# EAGLE design MOSFET power board (EAGLE 9.6.0)
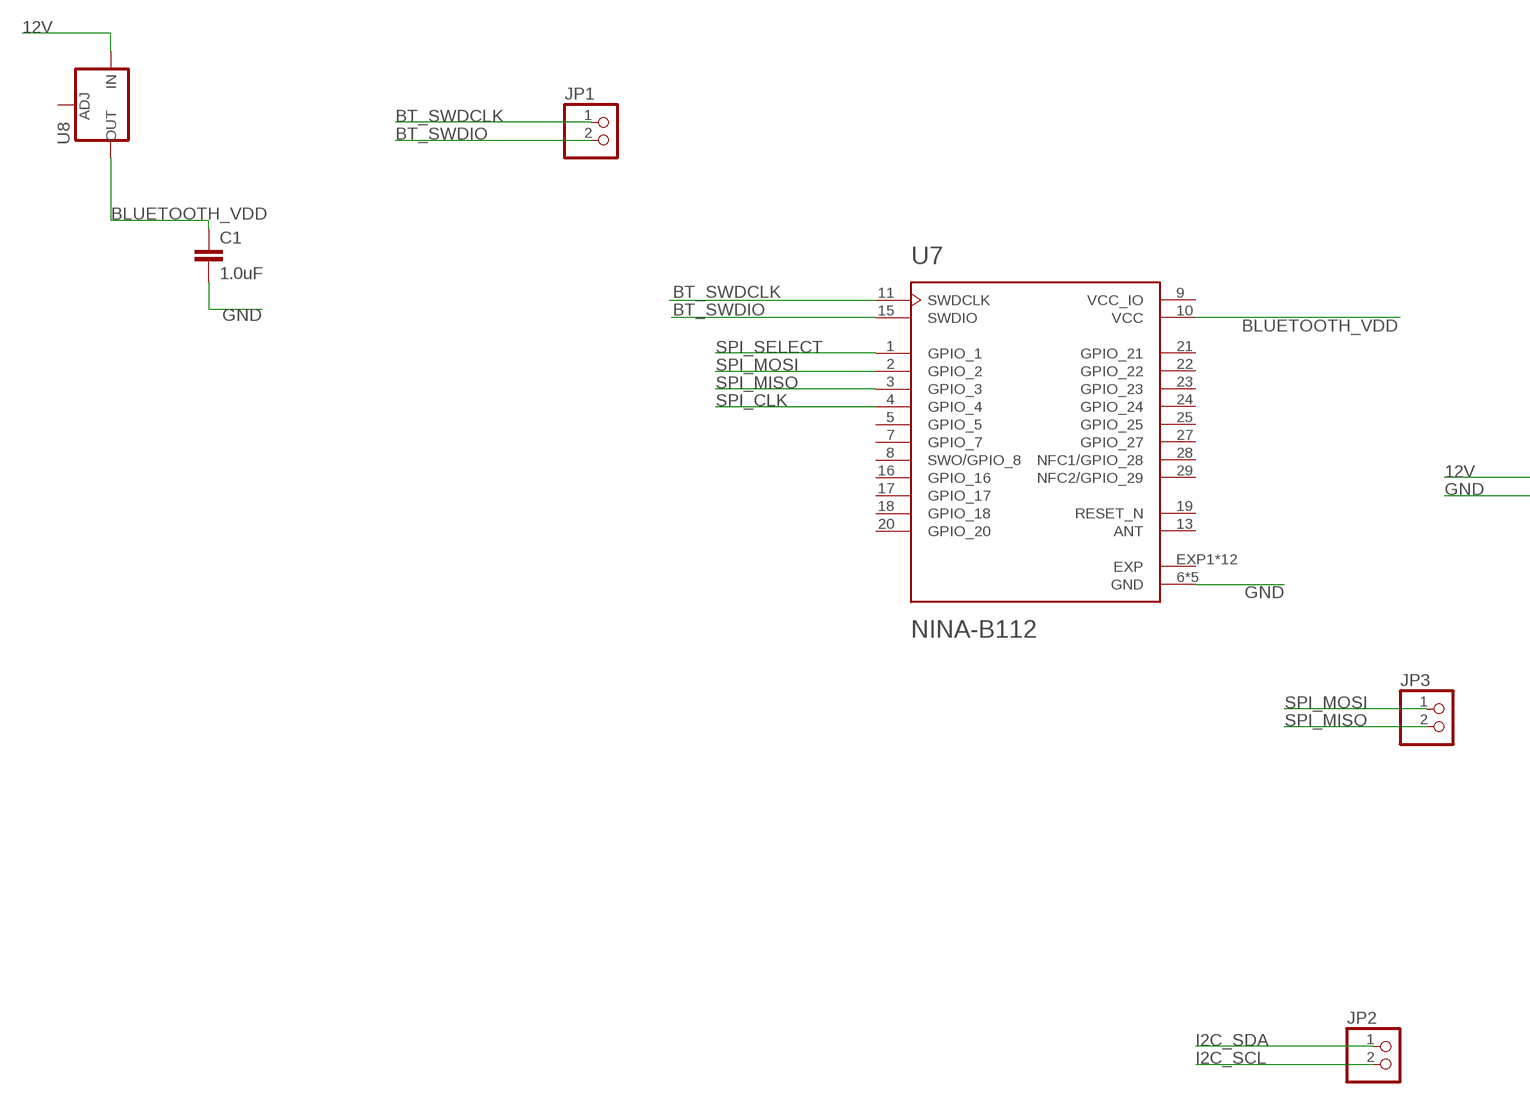
[diagram p0: schematic, sheet 1, part 1 of 2]
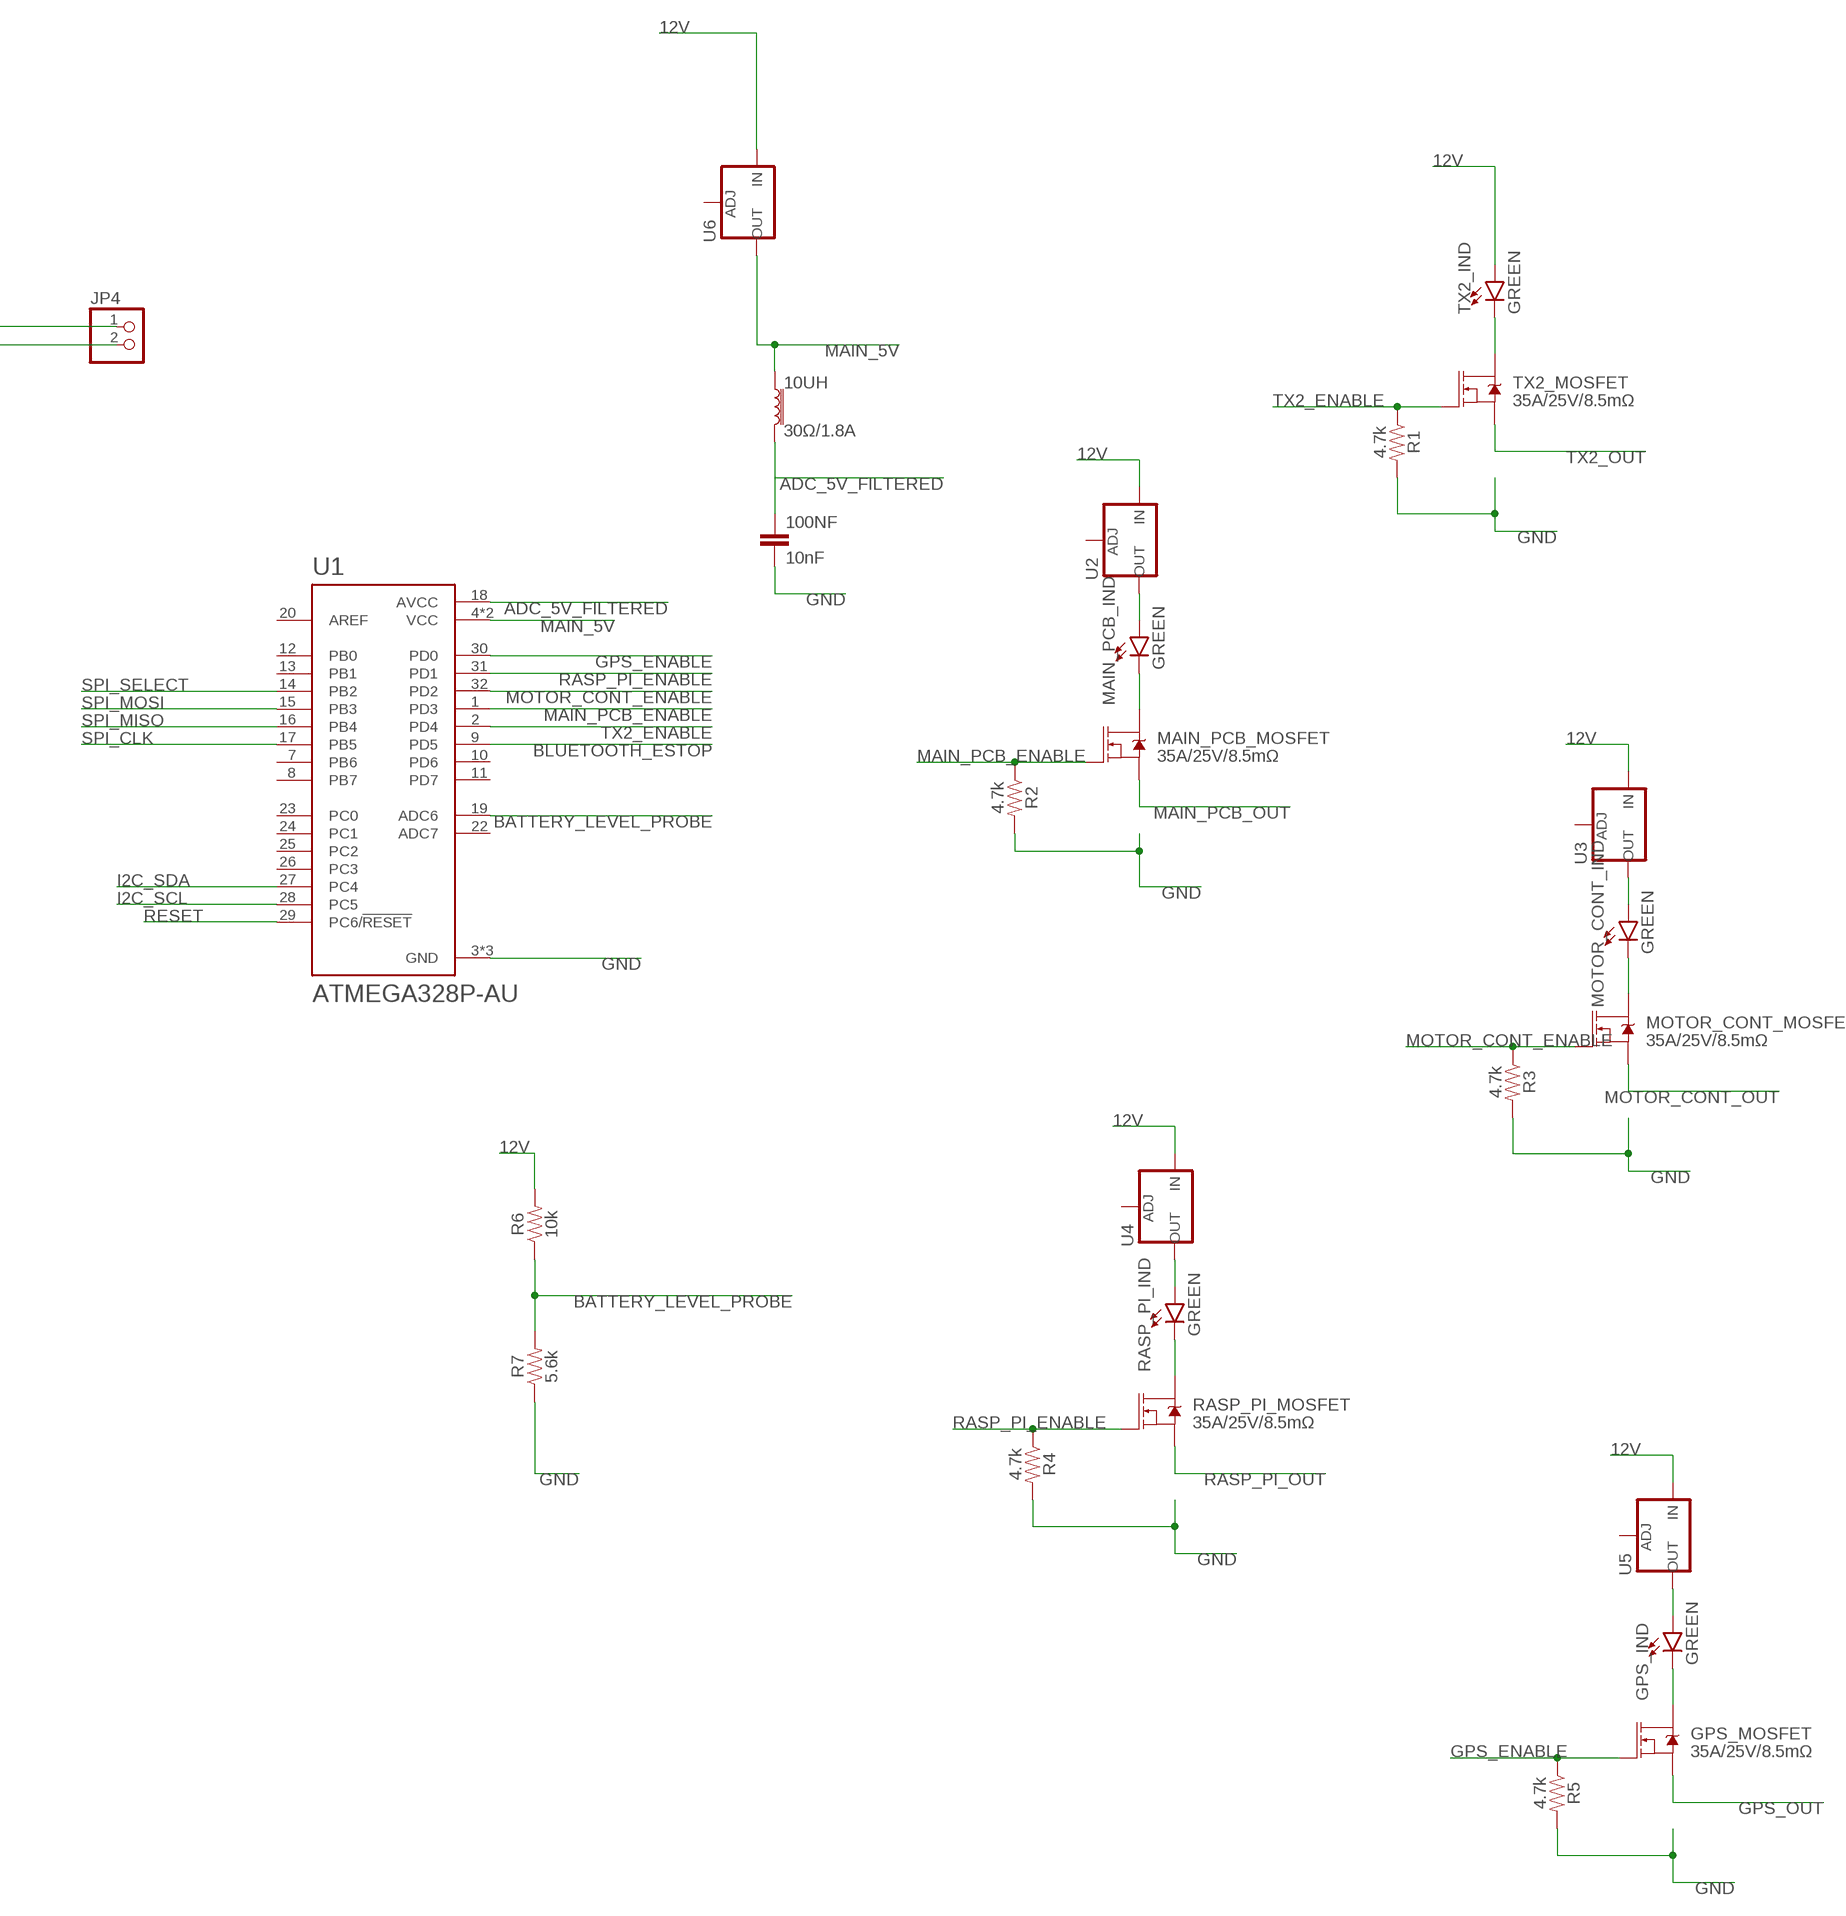
[diagram p1: schematic, sheet 1, part 2 of 2]

## Parts
10UH  30Ω/1.8A  FERRITE_BEAD-0603  [0603]
100NF  10nF  10NF-0603-50V-10%  [0603]
C1  1.0uF  1.0UF-0603-16V-10%  [0603]
GPS_IND  GREEN  LED-GREEN0603  [LED-0603]
GPS_MOSFET  35A/25V/8.5mΩ  MOSFET-NCH-FDD8780  [DPAK]
JP1  PINHD-1X2  [1X02]
JP2  PINHD-1X2  [1X02]
JP3  PINHD-1X2  [1X02]
JP4  PINHD-1X2  [1X02]
MAIN_PCB_IND  GREEN  LED-GREEN0603  [LED-0603]
MAIN_PCB_MOSFET  35A/25V/8.5mΩ  MOSFET-NCH-FDD8780  [DPAK]
MOTOR_CONT_IND  GREEN  LED-GREEN0603  [LED-0603]
MOTOR_CONT_MOSFET  35A/25V/8.5mΩ  MOSFET-NCH-FDD8780  [DPAK]
R1  4.7k  4.7KOHM-0603-1/10W-1%  [0603]
R2  4.7k  4.7KOHM-0603-1/10W-1%  [0603]
R3  4.7k  4.7KOHM-0603-1/10W-1%  [0603]
R4  4.7k  4.7KOHM-0603-1/10W-1%  [0603]
R5  4.7k  4.7KOHM-0603-1/10W-1%  [0603]
R6  10k  10KOHM-0603-1/10W-1%  [0603]
R7  5.6k  5.6KOHM-0603-1/10W-1%  [0603]
RASP_PI_IND  GREEN  LED-GREEN0603  [LED-0603]
RASP_PI_MOSFET  35A/25V/8.5mΩ  MOSFET-NCH-FDD8780  [DPAK]
TX2_IND  GREEN  LED-GREEN0603  [LED-0603]
TX2_MOSFET  35A/25V/8.5mΩ  MOSFET-NCH-FDD8780  [DPAK]
U1  ATMEGA328P-AU  [QFP80P900X900X120-32N]
U2  V_REG_LM1117SOT223  [SOT223]
U3  V_REG_LM1117SOT223  [SOT223]
U4  V_REG_LM1117SOT223  [SOT223]
U5  V_REG_LM1117SOT223  [SOT223]
U6  V_REG_LM1117SOT223  [SOT223]
U7  NINA-B112  [UBLOX_NINA-B112]
U8  V_REG_LM1117SOT223  [SOT223]

## Nets
12V: JP4.1 R6.2 TX2_IND.A U2.3(IN) U3.3(IN) U4.3(IN) U5.3(IN) U6.3(IN) U8.3(IN)
ADC_5V_FILTERED: 10UH.2 100NF.1 U1.18(AVCC)
BATTERY_LEVEL_PROBE: R6.1 R7.2 U1.19(ADC6)
BLUETOOTH_ESTOP: U1.9(PD5)
BLUETOOTH_VDD: C1.1 U7.10(VCC) U8.2(OUT) U8.4(OUT)
BT_SWDCLK: JP1.1 U7.11(SWDCLK)
BT_SWDIO: JP1.2 U7.15(SWDIO)
GND: 100NF.2 C1.2 JP4.2 R1.2 R2.2 R3.2 R4.2 R5.2 R7.1 U1.3(GND) U1.5(GND) U1.21(GND) U7.6(GND) U7.12(GND) U7.14(GND) U7.26(GND) U7.30(GND)
GPS_ENABLE: GPS_MOSFET.1(G) R5.1 U1.30(PD0)
GPS_OUT: GPS_MOSFET.3(S)
I2C_SCL: JP2.2 U1.28(PC5)
I2C_SDA: JP2.1 U1.27(PC4)
MAIN_5V: 10UH.1 U1.4(VCC) U1.6(VCC) U6.2(OUT) U6.4(OUT)
MAIN_PCB_ENABLE: MAIN_PCB_MOSFET.1(G) R2.1 U1.1(PD3)
MAIN_PCB_OUT: MAIN_PCB_MOSFET.3(S)
MOTOR_CONT_ENABLE: MOTOR_CONT_MOSFET.1(G) R3.1 U1.32(PD2)
MOTOR_CONT_OUT: MOTOR_CONT_MOSFET.3(S)
N$1: MAIN_PCB_IND.C MAIN_PCB_MOSFET.4(D)
N$2: MAIN_PCB_IND.A U2.2(OUT) U2.4(OUT)
N$3: MOTOR_CONT_IND.C MOTOR_CONT_MOSFET.4(D)
N$4: MOTOR_CONT_IND.A U3.2(OUT) U3.4(OUT)
N$5: RASP_PI_IND.C RASP_PI_MOSFET.4(D)
N$6: RASP_PI_IND.A U4.2(OUT) U4.4(OUT)
N$7: GPS_IND.C GPS_MOSFET.4(D)
N$8: GPS_IND.A U5.2(OUT) U5.4(OUT)
N$9: TX2_IND.C TX2_MOSFET.4(D)
RASP_PI_ENABLE: R4.1 RASP_PI_MOSFET.1(G) U1.31(PD1)
RASP_PI_OUT: RASP_PI_MOSFET.3(S)
RESET: U1.29(PC6/!RESET)
SPI_CLK: U1.17(PB5) U7.4(GPIO_4)
SPI_MISO: JP3.2 U1.16(PB4) U7.3(GPIO_3)
SPI_MOSI: JP3.1 U1.15(PB3) U7.2(GPIO_2)
SPI_SELECT: U1.14(PB2) U7.1(GPIO_1)
TX2_ENABLE: R1.1 TX2_MOSFET.1(G) U1.2(PD4)
TX2_OUT: TX2_MOSFET.3(S)
Unconnected: U1.7(PB6) U1.8(PB7) U1.10(PD6) U1.11(PD7) U1.12(PB0) U1.13(PB1) U1.20(AREF) U1.22(ADC7) U1.23(PC0) U1.24(PC1) U1.25(PC2) U1.26(PC3) U2.1(ADJ) U3.1(ADJ) U4.1(ADJ) U5.1(ADJ) U6.1(ADJ) U7.5(GPIO_5) U7.7(GPIO_7) U7.8(SWO/GPIO_8) U7.13(ANT) U7.16(GPIO_16) U7.17(GPIO_17) U7.18(GPIO_18) U7.19(RESET_N) U7.20(GPIO_20) U7.21(GPIO_21) U7.22(GPIO_22) U7.23(GPIO_23) U7.24(GPIO_24) U7.25(GPIO_25) U7.27(GPIO_27) U7.28(NFC1/GPIO_28) U7.29(NFC2/GPIO_29) U8.1(ADJ)

## Power pins joined to a net without a drawn wire
EXP: U7.EXP1(EXP) U7.EXP2(EXP) U7.EXP3(EXP) U7.EXP4(EXP) U7.EXP5(EXP) U7.EXP6(EXP) U7.EXP7(EXP) U7.EXP8(EXP) U7.EXP9(EXP) U7.EXP10(EXP) U7.EXP11(EXP) U7.EXP12(EXP)
VCC_IO: U7.9(VCC_IO)

## Library data of the parts
10UH = SparkFun-Coils:FERRITE_BEAD: Ferrite Bead (blocks, cores, rings, chokes, etc.) Inductor with layers of ferrite used to suppress high frequencies. Often used to isolate high frequency noise. SparkFun Products: IOIO-OTG - V2.2 <https://www.sparkfun.com/products/13613> SparkFun SAMD21 Mini Breakout <https://www.sparkfun.com/products/13664> SparkFun 6 Degrees of Freedom Breakout - LSM6DS3 <https://www.sparkfun.com/products/13339> SparkFun SAMD21 Dev Breakout <https://www.sparkfun.com/products/13672>; PROD_ID: NDUC-13805
100NF = SparkFun-Capacitors:10NF: 0.01uF/10nF/10,000pF ceramic capacitors A capacitor is a passive two-terminal electrical component used to store electrical energy temporarily in an electric field. CAP-09321; PROD_ID: CAP-00867
C1 = SparkFun-Capacitors:1.0UF: 1µF ceramic capacitors A capacitor is a passive two-terminal electrical component used to store electrical energy temporarily in an electric field.; PROD_ID: CAP-00868
GPS_IND MAIN_PCB_IND MOTOR_CONT_IND RASP_PI_IND TX2_IND = SparkFun-LED:LED-GREEN: Green SMD LED Used in manufacturing of various products at SparkFun Packages: 0603 - SMD 0603 package [Product Link] <http://www.futureelectronics.com/en/technologies/semiconductors/optoelectronics/leds/Pages/9894312-LTST-C190GKT.aspx?CrossPart=HSMG-C190&IM=0> LilyPad 1206 - SMD1206 LilyPad package [Product Link] <http://www.futureelectronics.com/en/Technologies/Product.aspx?ProductID=IN150NGHARVATEKCORPORATION2049943&IM=0> 1206 - SMD1206 package [Product Link] <http://www.futureelectronics.com/en/technologies/semiconductors/optoelectronics/leds/Pages/8315665-LTST-C150KGKT.aspx?IM=0> 1206 Bottom Mount -SMD 1206 Bottom Mount [Product Link] <http://www.digikey.com/product-detail/en/lite-on-inc/LTST-C230KGKT/160-1456-1-ND/386854> SparkFun Products: Pro Mini 328 -5V <https://www.sparkfun.com/products/821> RedBoard <https://www.sparkfun.com/products/12757> MP3 Trigger <https://www.sparkfun.com/products/13720> Makey Makey <https://www.sparkfun.com/products/11076>; PROD_ID: DIO-00821
GPS_MOSFET MAIN_PCB_MOSFET MOTOR_CONT_MOSFET RASP_PI_MOSFET TX2_MOSFET = SparkFun-DiscreteSemi:MOSFET-NCH: N-channel MOSFETs Voltage controlled devices that allow control of high current outputs. SparkFun Products: SparkFun OpenScale <https://www.sparkfun.com/products/13261> SparkFun Digital Sandbox <https://www.sparkfun.com/products/12651> SparkFun Monster Moto Shield <https://www.sparkfun.com/products/10182> SparkFun MOSFET Power Controller <https://www.sparkfun.com/products/11214>; PROD_ID: TRANS-09984
JP1-JP4 = pinhead:PINHD-1X2: PIN HEADER
R1-R5 = SparkFun-Resistors:4.7KOHM: 4.7kΩ resistor A resistor is a passive two-terminal electrical component that implements electrical resistance as a circuit element. Resistors act to reduce current flow, and, at the same time, act to lower voltage levels within circuits. - Wikipedia; PROD_ID: RES-07857
R6 = SparkFun-Resistors:10KOHM: 10kΩ resistor A resistor is a passive two-terminal electrical component that implements electrical resistance as a circuit element. Resistors act to reduce current flow, and, at the same time, act to lower voltage levels within circuits. - Wikipedia; PROD_ID: RES-00824
R7 = SparkFun-Resistors:5.6KOHM: 5.6kΩ resistor A resistor is a passive two-terminal electrical component that implements electrical resistance as a circuit element. Resistors act to reduce current flow, and, at the same time, act to lower voltage levels within circuits. - Wikipedia; PROD_ID: RES-12378
U1 = ATMEGA328P-AU:ATMEGA328P-AU: ATmega Series 20 MHz 32 KB Flash 2 KB SRAM 8-Bit Microcontroller - TQFP-32; AVAILABILITY: Unavailable; DESCRIPTION: AVR AVR® ATmega Microcontroller IC 8-Bit 20MHz 32KB _16K x 16_ FLASH 32-TQFP _7x7_; MF: Microchip Technology; MP: ATMEGA328P-AU; PACKAGE: TQFP-32 Microchip Technology; PRICE: None
U2-U6 U8 = SparkFun-IC-Power:V_REG_LM1117: Voltage Regulator LM1117 Standard adjustable voltage regulator but in SMD form. Spark Fun Electronics SKU : COM-00595; PROD_ID: VREG-08170
U7 = NINA-B112:NINA-B112: Rf Txrx Mod Bluetooth Stamp Ant; AVAILABILITY: Unavailable; DESCRIPTION: Bluetooth Bluetooth v5.0 Transceiver Module 2.4GHz Integrated, Chip Surface Mount; MF: U-Blox America; MP: NINA-B112; PACKAGE: SMD-30 u-blox; PRICE: None

## Board
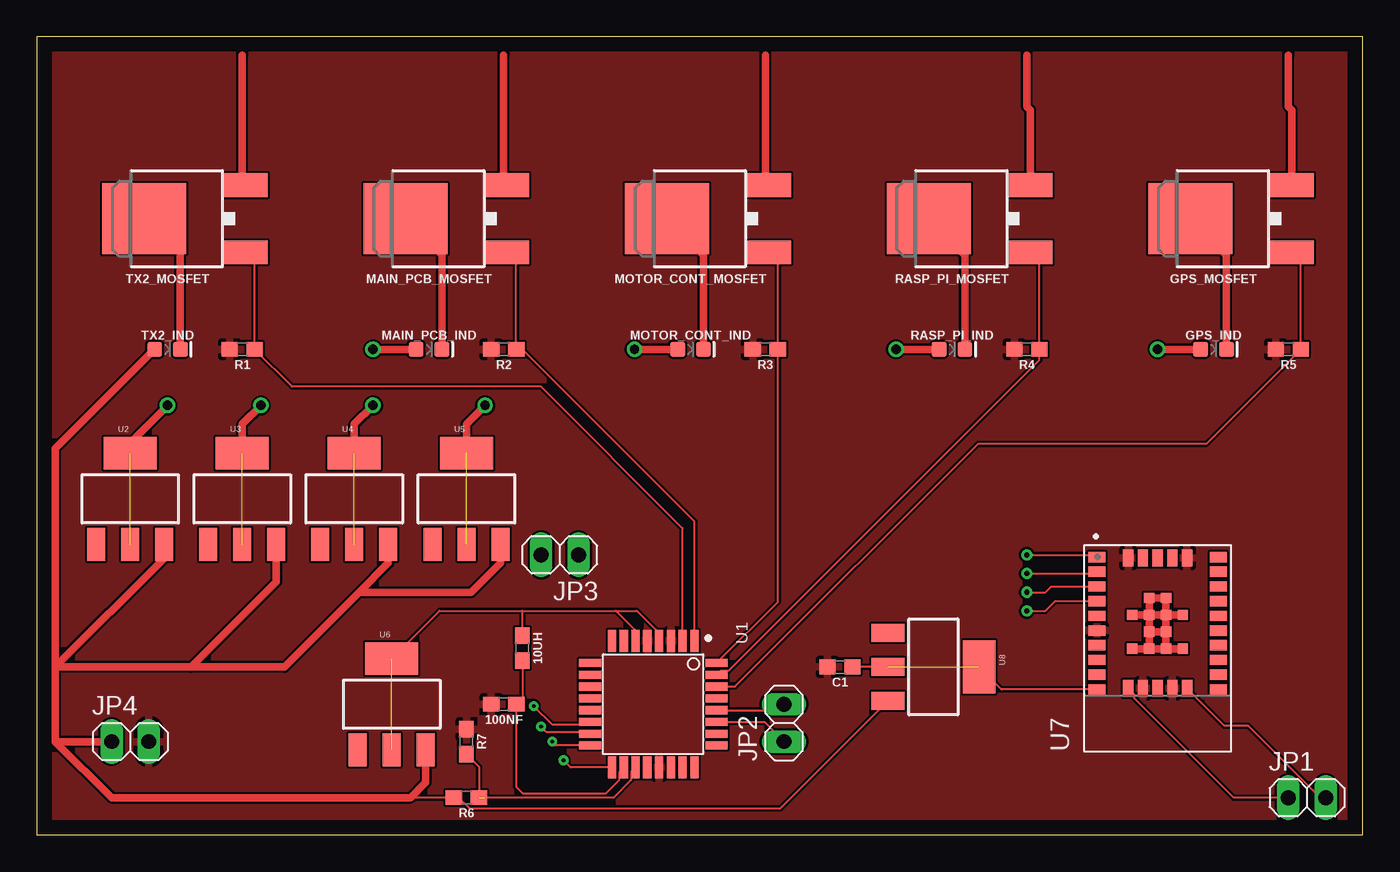
[diagram p2: board, top side]
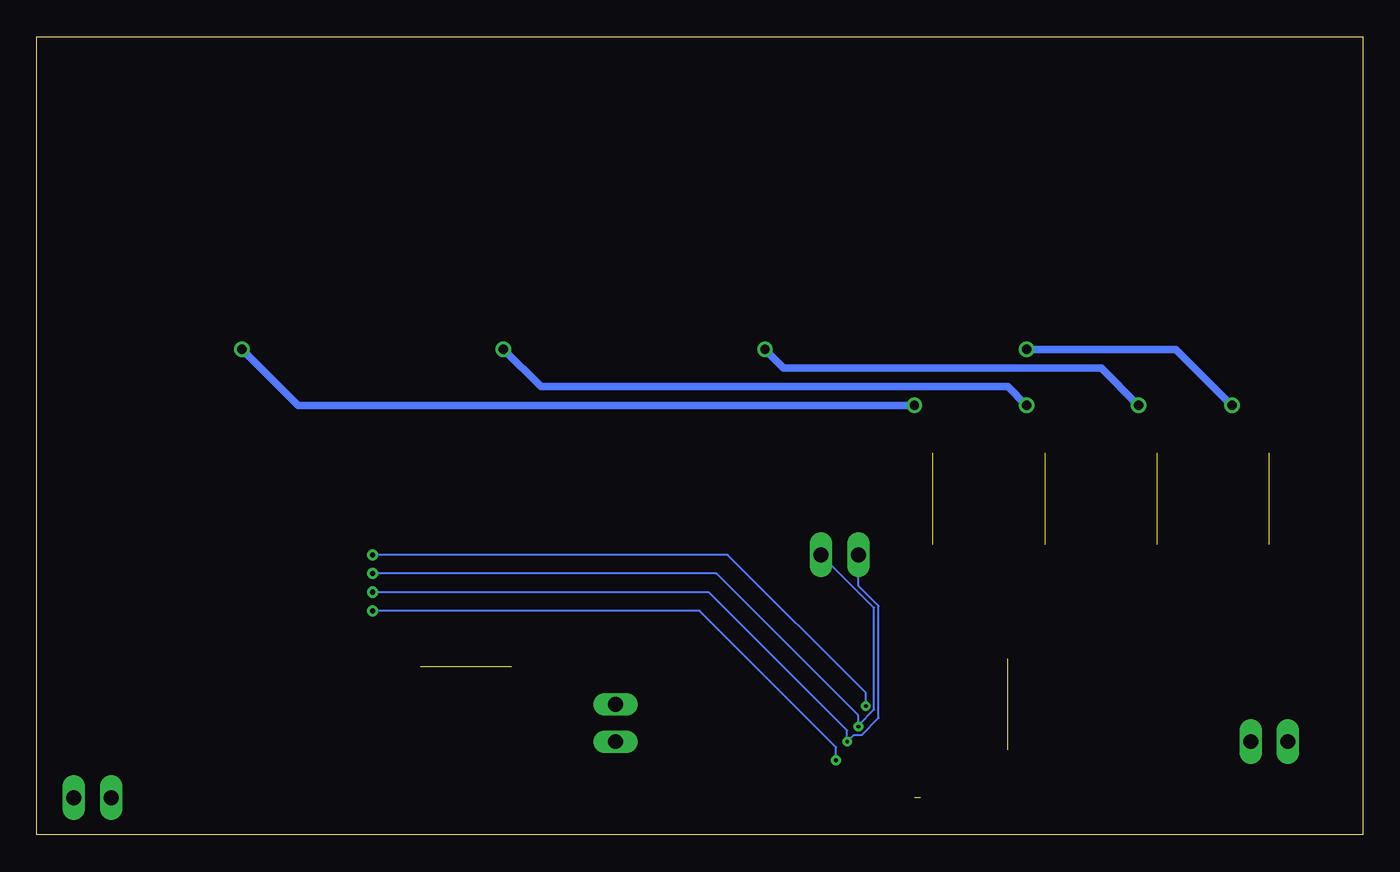
[diagram p3: board, bottom side, seen from below]

Size 90.15 x 54.28 mm. Coordinates in mm from the lower left corner, seen from the top.
Outline: 0,0 90.15,0 90.15,54.28 0,54.28 0,0
Copper layers (1*16): Top 0.035mm / dielectric 1.5mm / Bottom 0.035mm
Design rules "default": minimum track width 6mil, minimum drill 0.35mm, track to track 6mil, track to pad 6mil, pad to pad 6mil, via to via 6mil, smd to smd 6mil, copper to edge 40mil, drill to drill 6mil, minimum pad ring 10mil, minimum via ring 8mil, stop-mask expansion 4mil, vias tented up to drill 0mil, thermal gap 10mil

### Footprints (pad centres in the part's own frame; a part is rotated, then mirrored left to right if it is on the bottom)
0603 = smd 1.1 x 1: 1 -0.85,0; 2 0.85,0
LED-0603 = smd 1 x 1: A -0.877,0; C 0.877,0
DPAK = smd 1.6 x 3: 1 -2.28,-5.31; 3 2.28,-5.31 | smd 4.826 x 5.715: 4 0,1.588
1X02 = drill 1.016 long: 1 -1.27,0; 2 1.27,0
QFP80P900X900X120-32N = smd 1.5 x 0.55: 1 -4.3,2.8; 2 -4.3,2; 3 -4.3,1.2; 4 -4.3,0.4; 5 -4.3,-0.4; 6 -4.3,-1.2; 7 -4.3,-2; 8 -4.3,-2.8; 17 4.3,-2.8; 18 4.3,-2; 19 4.3,-1.2; 20 4.3,-0.4; 21 4.3,0.4; 22 4.3,1.2; 23 4.3,2; 24 4.3,2.8 | smd 0.55 x 1.5: 9 -2.8,-4.3; 10 -2,-4.3; 11 -1.2,-4.3; 12 -0.4,-4.3; 13 0.4,-4.3; 14 1.2,-4.3; 15 2,-4.3; 16 2.8,-4.3; 25 2.8,4.3; 26 2,4.3; 27 1.2,4.3; 28 0.4,4.3; 29 -0.4,4.3; 30 -1.2,4.3; 31 -2,4.3; 32 -2.8,4.3
SOT223 = smd 1.219 x 2.235: 1 -2.311,-3.099; 2 0,-3.099; 3 2.311,-3.099 | smd 3.6 x 2.2: 4 0,3.099
UBLOX_NINA-B112 = smd 0.7 x 1.15: 1 6.2,4.125; 2 5.2,4.125; 3 4.2,4.125; 4 3.2,4.125; 5 2.2,4.125; 6 1.2,4.125; 7 0.2,4.125; 8 -0.8,4.125; 9 -1.8,4.125; 10 -2.8,4.125; 16 -2.8,-4.125; 17 -1.8,-4.125; 18 -0.8,-4.125; 19 0.2,-4.125; 20 1.2,-4.125; 21 2.2,-4.125; 22 3.2,-4.125; 23 4.2,-4.125; 24 5.2,-4.125; 25 6.2,-4.125 | smd 1.15 x 0.7: 11 -2.725,2; 12 -2.725,1; 13 -2.725,0; 14 -2.725,-1; 15 -2.725,-2; 26 6.125,-2; 27 6.125,-1; 28 6.125,0; 29 6.125,1; 30 6.125,2 | smd 0.7 x 0.7: EXP1 -0.03,1.725; EXP2 -0.03,0.575; EXP3 -0.03,-0.575; EXP4 -0.03,-1.725; EXP5 1.12,-0.575; EXP6 1.12,0.575; EXP7 2.27,1.725; EXP8 2.27,0.575; EXP9 2.27,-0.575; EXP10 2.27,-1.725; EXP11 3.42,-0.575; EXP12 3.42,0.575

### Placement (x,y rotation side)
10UH  33.02,12.7 270 top
100NF  31.75,8.89 180 top
C1  54.61,11.43 180 top
GPS_IND  80.01,33.02 0 top
GPS_MOSFET  80.01,41.91 90 top
JP1  86.36,2.54 0 top
JP2  50.8,7.62 90 top
JP3  35.56,19.05 180 top
JP4  6.35,6.35 0 top
MAIN_PCB_IND  26.67,33.02 0 top
MAIN_PCB_MOSFET  26.67,41.91 90 top
MOTOR_CONT_IND  44.45,33.02 0 top
MOTOR_CONT_MOSFET  44.45,41.91 90 top
R1  13.97,33.02 180 top
R2  31.75,33.02 180 top
R3  49.53,33.02 180 top
R4  67.31,33.02 180 top
R5  85.09,33.02 180 top
R6  29.21,2.54 180 top
R7  29.21,6.35 270 top
RASP_PI_IND  62.23,33.02 0 top
RASP_PI_MOSFET  62.23,41.91 90 top
TX2_IND  8.89,33.02 0 top
TX2_MOSFET  8.89,41.91 90 top
U1  41.91,8.89 270 top
U2  6.35,22.86 0 top
U3  13.97,22.86 0 top
U4  21.59,22.86 0 top
U5  29.21,22.86 0 top
U6  24.13,8.89 0 top
U7  76.2,12.7 90 top
U8  60.96,11.43 270 top

### Tracks (layer width: path | path; a pad name or v marks a point on that pad's centre or on a via)
12V
  Top 0.152: TX2_IND.A 7.82,32.82 | 25.4,2.54 R6.2 28.69,2.54 29.41,1.81 50.55,1.81 U8.3
  Top 0.508: 1.27,11.43 1.27,26.28 7.82,32.82 | U2.3 8.66,18.82 1.27,11.43 | U3.3 16.28,17.22 10.49,11.43 | 10.49,11.43 1.27,11.43 | U4.3 23.9,18.49 21.92,16.51 | 10.49,11.43 16.84,11.43 21.92,16.51 | U5.3 31.52,18.49 29.54,16.51 21.92,16.51 | 1.27,6.35 1.27,11.43 | U6.3 26.44,3.58 25.4,2.54 5.08,2.54 1.27,6.35 | JP4.1 1.27,6.35
ADC_5V_FILTERED
  Top 0.152: 10UH.2 33.02,9.31 100NF.1 32.6,3.27 33.02,2.85 38.71,2.85 39.61,3.75 39.61,4.29 U1.18
BATTERY_LEVEL_PROBE  (1 unrouted)
  Top 0.152: U1.19 40.41,4.29 40.41,3.75 39.21,2.54 30.48,2.54 | R7.2 30.06,4.65 R6.1
BLUETOOTH_VDD  (1 unrouted)
  Top 0.152: U8.2 C1.1 | U7.10 65.59,9.9 U8.4
BT_SWDCLK
  Top 0.152: U7.11 74.62,9.55 74.62,9.3 81.39,2.54 JP1.1
BT_SWDIO
  Top 0.152: U7.15 80.74,7.43 82.36,7.43 87.25,2.54 JP1.2
EXP
  Top 0.508: U7.EXP9 U7.EXP11 U7.EXP12 U7.EXP8 | U7.EXP9 U7.EXP8 | U7.EXP8 U7.EXP7 | U7.EXP8 U7.EXP6 | U7.EXP6 U7.EXP2 | U7.EXP9 U7.EXP10 | U7.EXP9 U7.EXP5 | U7.EXP5 U7.EXP6 | U7.EXP2 U7.EXP3 | U7.EXP5 U7.EXP3 | U7.EXP3 U7.EXP4 | U7.EXP2 U7.EXP1
GND
  pour Top: -5.08,57.15 -6.35,55.88 -6.35,-5.08 96.52,-5.08 96.52,64.77 88.9,57.15
GPS_ENABLE
  Top 0.152: U1.30 47.48,10.09 63.99,26.6 79.52,26.6 R5.1 85.94,39.01 GPS_MOSFET.1
GPS_OUT
  Top 0.508: GPS_MOSFET.3 85.32,49.3 85.09,49.53 85.09,53.01
I2C_SCL
  Top 0.152: U1.28 50.4,8.49 JP2.2
I2C_SDA
  Top 0.152: U1.27 49.46,7.69 JP2.1
MAIN_5V  (1 unrouted)
  Top 0.152: U6.4 27.38,15.24 33.02,15.24 | 33.02,15.24 39.37,15.24 | 39.37,15.24 40.71,13.9 U1.6 | U1.4 42.27,13.23 42.27,13.78 40.81,15.24 39.37,15.24 | 10UH.1 33.02,15.24
MAIN_PCB_ENABLE
  Top 0.152: U1.1 44.71,21.33 33.02,33.02 R2.1 32.6,39.01 MAIN_PCB_MOSFET.1
MAIN_PCB_OUT
  Top 0.508: MAIN_PCB_MOSFET.3 31.75,44.42 31.75,53.01
MOTOR_CONT_ENABLE
  Top 0.152: U1.32 50.38,15.86 R3.1 50.38,39.01 MOTOR_CONT_MOSFET.1
MOTOR_CONT_OUT
  Top 0.508: MOTOR_CONT_MOSFET.3 49.53,44.42 49.53,53.01
N$1
  Top 0.508: MAIN_PCB_IND.C 27.55,39.45 MAIN_PCB_MOSFET.4
N$2  (via drill 0.64)  (1 unrouted)
  Top 0.508: v22.86,33.02 MAIN_PCB_IND.A | U2.4 6.35,26.67 v8.89,29.21
  Bottom 0.508: v8.89,29.21 12.7,33.02 v22.86,33.02
N$3
  Top 0.508: MOTOR_CONT_IND.C 45.33,39.45 MOTOR_CONT_MOSFET.4
N$4  (via drill 0.64)  (1 unrouted)
  Top 0.508: MOTOR_CONT_IND.A v40.64,33.02 | U3.4 13.97,27.94 v15.24,29.21
  Bottom 0.508: v15.24,29.21 17.78,31.75 39.37,31.75 v40.64,33.02
N$5
  Top 0.508: RASP_PI_IND.C 63.11,39.45 RASP_PI_MOSFET.4
N$6  (via drill 0.64)  (1 unrouted)
  Top 0.508: RASP_PI_IND.A v58.42,33.02 | U4.4 21.59,27.94 v22.86,29.21
  Bottom 0.508: v22.86,29.21 24.13,30.48 55.88,30.48 v58.42,33.02
N$7
  Top 0.508: GPS_IND.C 80.89,39.45 GPS_MOSFET.4
N$8  (via drill 0.64)  (1 unrouted)
  Top 0.508: GPS_IND.A v76.2,33.02 | U5.4 29.21,27.94 v30.48,29.21
  Bottom 0.508: v30.48,29.21 72.39,29.21 v76.2,33.02
N$9
  Top 0.152: 7.46,41.75 TX2_MOSFET.4
  Top 0.508: TX2_IND.C 9.77,41.03 8.89,41.91 7.62,41.91 7.46,41.75
RASP_PI_ENABLE
  Top 0.152: U1.31 46.51,11.19 47.05,11.19 68.16,32.29 R4.1 68.16,39.01 RASP_PI_MOSFET.1
RASP_PI_OUT
  Top 0.508: RASP_PI_MOSFET.3 67.54,49.3 67.31,49.53 67.31,53.01
SPI_CLK  (via drill 0.25, 0.35)
  Top 0.152: U1.17 36.3,4.59 v35.81,5.08 | v67.31,15.24 68.58,15.24 69.24,15.9 U7.4
  Bottom 0.152: v35.81,5.08 35.81,5.97 45.09,15.24 v67.31,15.24
SPI_MISO  (via drill 0.25, 0.35)
  Top 0.152: U1.16 35.31,6.09 v35.05,6.35 | v67.31,16.51 68.58,16.51 68.97,16.9 U7.3
  Bottom 0.152: v67.31,16.51 44.45,16.51 35.05,7.11 v35.05,6.35 34.59,6.81 34.06,6.81 32.92,7.95 32.92,15.57 34.29,16.94 JP3.2
SPI_MOSI  (via drill 0.25, 0.35)
  Top 0.152: U1.15 37.52,6.99 34.67,6.99 v34.29,7.37 | v67.31,17.78 71.95,17.78 U7.2
  Bottom 0.152: v67.31,17.78 43.94,17.78 34.29,8.13 v34.29,7.37 34.29,7.47 33.23,8.53 33.23,15.45 JP3.1
SPI_SELECT  (via drill 0.25, 0.35)
  Top 0.152: U1.14 37.41,7.49 35.05,7.49 v33.78,8.76 | v67.31,19.05 71.92,19.05 U7.1
  Bottom 0.152: v33.78,8.76 33.78,9.65 43.18,19.05 v67.31,19.05
TX2_ENABLE
  Top 0.152: U1.2 43.91,20.86 34.29,30.48 17.36,30.48 R1.1 14.82,39.01 TX2_MOSFET.1
TX2_OUT
  Top 0.508: TX2_MOSFET.3 13.97,44.42 13.97,53.01